# EAGLE design Drive_Led_Test_Bleu (EAGLE 9.6.2)
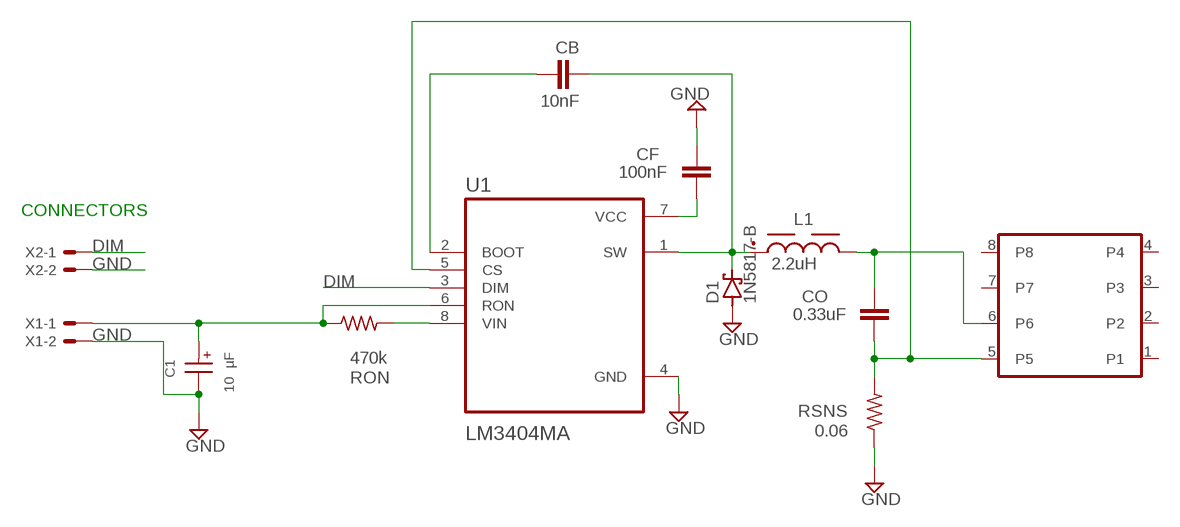
[diagram p0: schematic, sheet 1]

## Parts
C1  10 µF  WCAP-ASLL_4X5.5_865060440001  [WCAP-ASLL_4X5.5(DXL)]
CB  10nF  C-EUC0603  [C0603]
CF  100nF  C-EUC0603  [C0603]
CO  0.33uF  C-EUC0603  [C0603]
D1  1N5817-B  [DO41-7.6]
L1  2.2uH  WE-PDA_1260_784771022  [WE-PDA_1260]
RON  470k  R-US_R0603  [R0603]
RSNS  0.06  R-US_R0603  [R0603]
U1  LM3404MA  [SOIC127P599X175-8N]
U$1  LE_RTDUW_S2WM_DEVICE  [LE_RTDUW_S2WM_FOOTPRINT]
X1  22-23-2021  [22-23-2021]
X2  22-23-2021  [22-23-2021]

## Nets
DIM: U1.3(DIM) X2.1
GND: C1.2(-) CF.1 D1.A RSNS.1 U1.4(GND) X1.2 X2.2
N$1: RON.2 U1.8(VIN)
N$2: C1.1(+) RON.1 U1.6(RON) X1.1
N$3: CF.2 U1.7(VCC)
N$4: CB.1 U1.2(BOOT)
N$5: CB.2 D1.C L1.1 U1.1(SW)
N$6: CO.1 RSNS.2 U1.5(CS) U$1.5
N$7: CO.2 L1.2 U$1.6
Unconnected: U$1.3 U$1.4 U$1.7 U$1.8

## Notes on the sheet
- CONNECTORS

## Power pins joined to a net without a drawn wire
P1: U$1.1
P2: U$1.2

## Library data of the parts
C1 = Eagle_WCAP-ASLL (rev20a):WCAP-ASLL_4X5.5: WCAP-ASLL Aluminium Electrolytic Capacitors Low Impedance & Long Life +105 °C Characteristics Low impedance and long life product series Mounting style: V-Chip SMT Capacitance range: 1 µF ‒ 6800 µF Capacitance tolerance: ±20 % Voltage range (UR): 6.3 ‒ 450 V(DC) Operating temperature: -55 °C up to +105 °C for UR ≤ 100 V(DC) -40 °C up to +105 °C for UR > 100 V(DC) Endurance: 2000 ‒ 5000 h @ +105 °C Dimensions (DxL) in mm: 4.0 x 5.5 up to 16.0 x 17.0 Recommended soldering: Reflow soldering Applications Long life application & low impedance Input and output capacitor for switched-mode power supply Filtering Smoothing e.g. DC/DC converter, AC/DC converter, satellite receiver, control panel <https://www.we-online.com/catalog/media/o14724v209%20Family_WCAP-ASLL.jpg> Details see: https://www.we-online.com/catalog/en/WCAP-ASLL/ Updated by yingchun,Shan;2020-03-03 2020(C) Würth Elektronik; DATASHEET-URL: https://www.we-online.com/catalog/datasheet/865060440001.pdf; DF: 14%; DIAMETER: 4mm; I-LEAK: 3uA; I-RIPPLE: 90mA; L: 5.5mm; OPERATING-TEMPERATURE: -55 °C up to +105 °C; PART-NUMBER: 865060440001; TECHNICAL-REFERENCE: ASEB055100M025DVCTAB000; VR: 25V(DC); Z: 1.35Ohm
CB CF CO = rcl:C-EU: CAPACITOR, European symbol; SPICEPREFIX: C
D1 = diode:1N581*: 1.0A SCHOTTKY BARRIER RECTIFIER Source: http://www.diodes.com/datasheets/ds23001.pdf
L1 = Eagle_WE-PDA (rev20b):WE-PDA_1260: WE-PDA SMD Shielded Power Inductor Characteristics Magnetically shielded version which results in a low leakage field High storage capacity High Saturation currents up to 23 A Very low self-losses at high switching frequency's Wide inductance spectrum available at all sizes Operating Temperature -40 °C up to +125 °C Core Material: NiZn Wire connection: welding technology Applications Multimedia applications Switching regulators with low operating voltages Integrated DC/DC-converter Perfect suitable for switching regulators with extremely high efficiency (> 86 %) Plastic base: Because of the one piece construction these are more suitable for high vibration or shock applications <https://www.we-online.com/catalog/media/o55118v209%20Family_WE-PDA.jpg> Details see: https://www.we-online.com/katalog/en/WE-PDA Updated by Ella Wu 2020-03-18 2020(C) Wurth Elektronik; DATASHEET-URL: https://www.we-online.com/catalog/datasheet/784771022.pdf; FRES: 82.7MHz; IR: 7.2A; ISAT: 10.5A; MOUNT: SMT; PART-NUMBER: 784771022; RDC-MAX: 12.5mOhm; RDC-TYP: 10.5mOhm
RON RSNS = rcl:R-US_: RESISTOR, American symbol; SPICEPREFIX: R
U1 = LM3404MA:LM3404MA: Check availability <https://pricing.snapeda.com/parts/LM3404MA/NOPB/Texas%20Instruments/view-part?ref=eda>; AVAILABILITY: In Stock; DESCRIPTION: 42-V 1.0-A constant current buck LED driver; MF: Texas Instruments; MP: LM3404MA/NOPB; PACKAGE: SOIC-8 Texas Instruments; PRICE: None; PURCHASE-URL: https://pricing.snapeda.com/search/part/LM3404MA/NOPB/?ref=eda
U$1 = led_LE_RTDUW_S2WM:LE_RTDUW_S2WM_DEVICE
X1 X2 = con-molex:22-23-2021: .100" (2.54mm) Center Header - 2 Pin; MF: MOLEX; MPN: 22-23-2021; OC_FARNELL: 1462926; OC_NEWARK: 25C3832

## Board
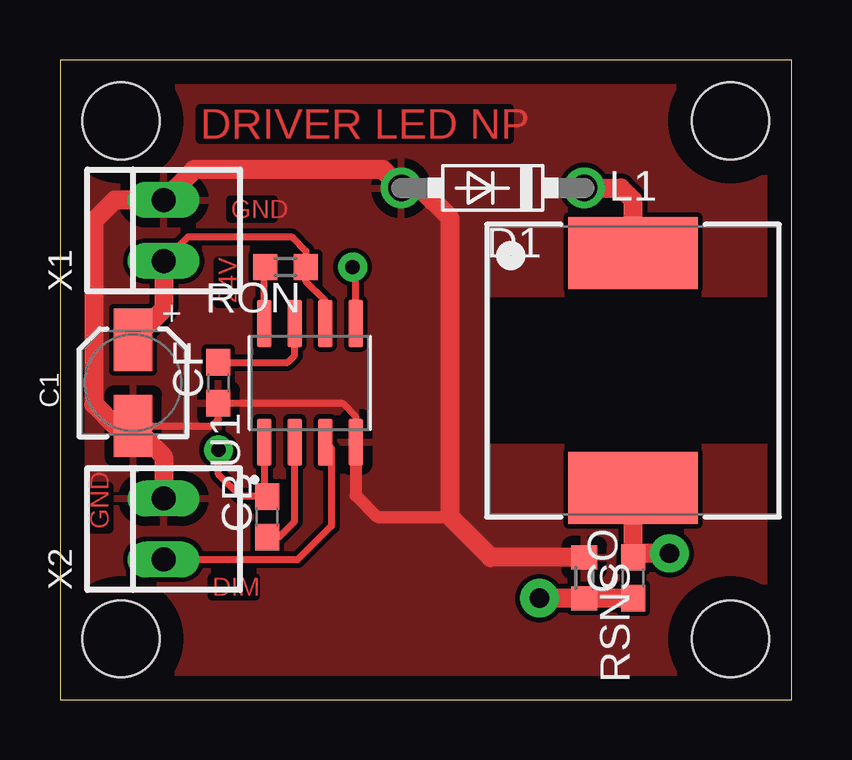
[diagram p1: board, top side]
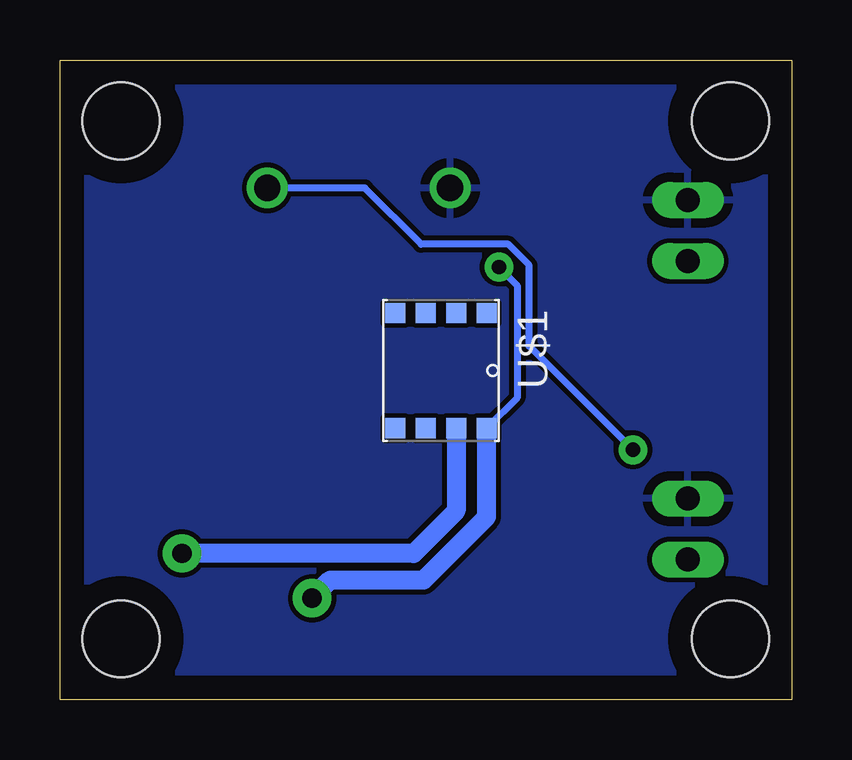
[diagram p2: board, bottom side, seen from below]

Size 30.48 x 26.67 mm. Coordinates in mm from the lower left corner, seen from the top.
Outline: 0,0 30.48,0 30.48,26.67 0,26.67 0,0
Copper layers (1*16): Top 0.035mm / dielectric 1.5mm / Bottom 0.035mm
Design rules "ENSEA_2022_04_08": minimum track width 0.2mm, minimum drill 0.6mm, track to track 0.2mm, track to pad 0.2mm, pad to pad 0.185mm, via to via 0.2mm, smd to smd 0.185mm, copper to edge 1mm, drill to drill 0.4mm, minimum pad ring 0.2mm, minimum via ring 0.2mm, stop-mask expansion 4mil, vias tented up to drill 0mil, thermal gap 0.4mm
Holes 3.2 mm at 2.54,2.54 2.54,24.13 27.94,24.13 27.94,2.54

### Footprints (pad centres in the part's own frame; a part is rotated, then mirrored left to right if it is on the bottom)
WCAP-ASLL_4X5.5(DXL) = smd 2.6 x 1.6: 1 1.8,0; 2 -1.8,0
C0603 = smd 1.1 x 1: 1 -0.85,0; 2 0.85,0
DO41-7.6 = drill 1.1 pad 1.7: A 3.81,0; C -3.81,0
WE-PDA_1260 = smd 5.4 x 3: 1 0,4.9; 2 0,-4.9
R0603 = smd 1 x 1.1: 1 -0.85,0; 2 0.85,0
SOIC127P599X175-8N = smd 1.97 x 0.6: 1 -2.47,1.905; 2 -2.47,0.635; 3 -2.47,-0.635; 4 -2.47,-1.905; 5 2.47,-1.905; 6 2.47,-0.635; 7 2.47,0.635; 8 2.47,1.905
LE_RTDUW_S2WM_FOOTPRINT = smd 0.85 x 0.85: 1 -2.4,-1.905; 2 -2.4,-0.635; 3 -2.4,0.635; 4 -2.4,1.905; 5 2.4,1.905; 6 2.4,0.635; 7 2.4,-0.635; 8 2.4,-1.905
22-23-2021 = drill 1 long: 1 -1.27,0; 2 1.27,0

### Placement (x,y rotation side)
C1  3.05,13.21 90 top
CB  8.64,7.62 90 top
CF  6.6,13.21 90 top
CO  23.88,5.08 90 top
D1  18.03,21.34 180 top
L1  23.88,13.72 0 top
RON  9.4,18.03 180 top
RSNS  21.84,5.08 270 top
U1  10.41,13.21 90 top
U$1  14.61,13.72 270 bottom
X1  4.32,19.56 90 top
X2  4.32,7.11 90 top

### Tracks (layer width: path | path; a pad name or v marks a point on that pad's centre or on a via)
DIM
  Top 0.3: X2.1 9.91,5.84 11.3,7.24 11.3,10.48 U1.3
GND
  Top 0.3: U1.4 12.32,11.81 11.77,12.36 CF.1 6.6,11.68 6.33,11.41 C1.2
  Top 0.5: U1.4 12.32,8.51 13.21,7.62 16.26,7.62
  Top 0.8: X2.2 4.32,10.14 C1.2 2.31,11.41 1.4,12.32 1.4,19.94 2.29,20.83 X1.2 5.59,22.1 13.46,22.1 D1.A 14.99,21.34 16.26,20.07 16.26,7.62 17.95,5.93 RSNS.1
  pour Bottom: 0,0 30.48,0 30.48,26.67 0,26.67
  pour Top: 0,0 30.48,0 30.48,26.67 0,26.67
N$1
  Top 0.3: U1.8 8.51,18 RON.2
N$2
  Top 0.3: U1.6 11.05,16.64 10.25,17.44 RON.1 10.25,18.71 9.65,19.3 5.33,19.3 X1.1
  Top 0.8: C1.1 4.32,16.28 X1.1
N$3
  Top 0.3: CF.2 9.49,14.06 9.78,14.35 U1.7
N$4
  Top 0.3: CB.1 9.11,6.77 9.78,7.44 U1.2
N$5  (via drill 0.6 pad 1.2)
  Top 0.3: U1.1 8.51,8.6 CB.2 7.53,8.47 6.6,9.4 v6.6,10.41
  Top 0.8: L1.1 23.88,20.83 23.37,21.34 D1.C
  Bottom 0.3: D1.C 17.78,21.34 15.43,18.98 11.8,18.98 10.93,18.12 10.93,14.74 v6.6,10.41
N$6  (via drill 0.6 pad 1.2, 0.8 pad 1.6)
  Top 0.3: U1.5 12.32,17.91 v12.19,18.03
  Top 0.8: CO.1 RSNS.2 v19.98,4.23
  Bottom 0.3: v12.19,18.03 11.43,17.27 11.43,12.59 U$1.5
  Bottom 0.8: U$1.5 12.7,7.62 15.33,4.99 19.22,4.99 v19.98,4.23
N$7  (via drill 0.8 pad 1.6)
  Top 0.8: L1.2 CO.2 24.04,6.1 v25.4,6.1
  Bottom 0.8: U$1.6 13.97,7.87 15.75,6.1 v25.4,6.1

### Text on the board
Top: DRIVER LED NP | GND | 24V | GND | DIM